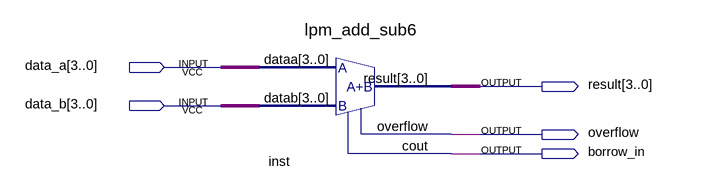
[diagram p0: schematic sheet]
// Quartus schematic Block1.bdf as structural Verilog: 1 symbols, 5 pins
module Block1 (
  input  [3:0] data_a,
  input  [3:0] data_b,
  output [3:0] result,
  output overflow,
  output borrow_in
);

  lpm_add_sub6 inst (.dataa(data_a), .datab(data_b), .result(result), .overflow(overflow), .cout(borrow_in));
endmodule
